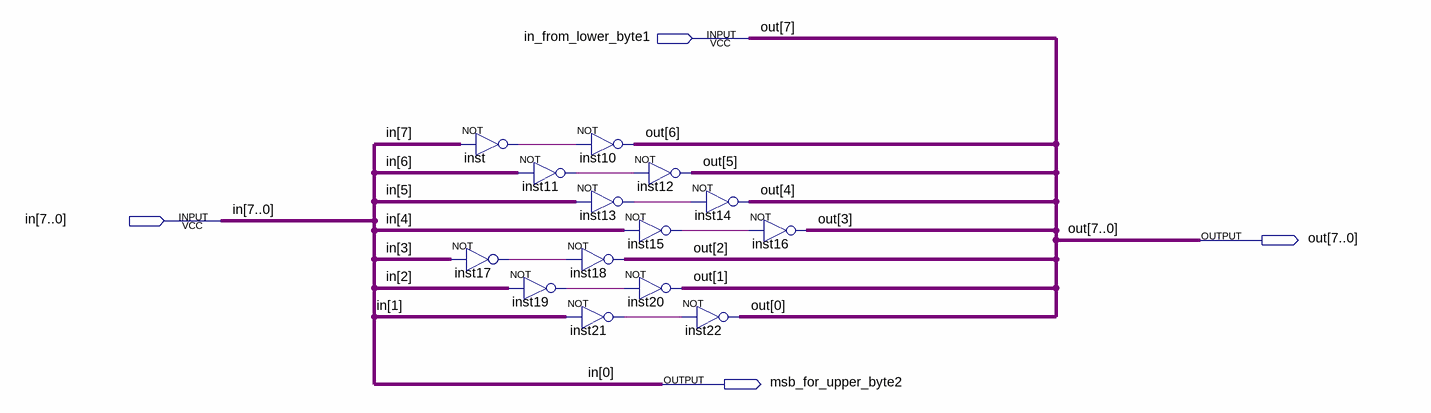
[diagram p0: schematic sheet]
// Quartus schematic ASRD.bdf as structural Verilog: 14 symbols, 4 pins
module ASRD (
  input  in_from_lower_byte1,
  input  [7:0] in,
  output [7:0] out,
  output msb_for_upper_byte2
);

  wire inst11_out, inst13_out, inst15_out, inst17_out, inst19_out, inst21_out, inst_out;

  not inst (inst_out, in[7]);
  not inst11 (inst11_out, in[6]);
  not inst17 (inst17_out, in[3]);
  not inst19 (inst19_out, in[2]);
  not inst10 (out[6], inst_out);
  not inst13 (inst13_out, in[5]);
  not inst18 (out[2], inst17_out);
  not inst21 (inst21_out, in[1]);
  not inst12 (out[5], inst11_out);
  not inst15 (inst15_out, in[4]);
  not inst20 (out[1], inst19_out);
  not inst14 (out[4], inst13_out);
  not inst16 (out[3], inst15_out);
  not inst22 (out[0], inst21_out);

  assign msb_for_upper_byte2 = in[0];
  assign out[7] = in_from_lower_byte1;
endmodule
